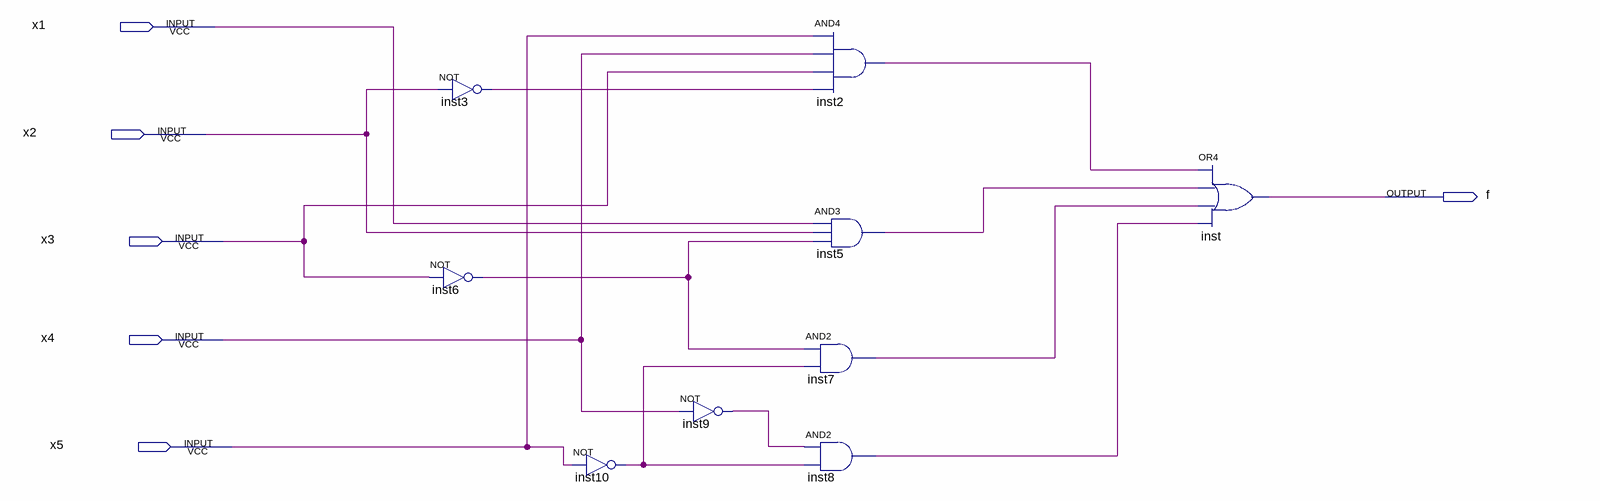
[diagram p0: schematic sheet]
// Quartus schematic Problem1_question3.bdf as structural Verilog: 9 symbols, 6 pins
module Problem1_question3 (
  input  x1,
  input  x2,
  input  x3,
  input  x4,
  input  x5,
  output f
);

  wire inst2_out, inst3_out, inst5_out, inst6_out, inst7_out, inst8_out, inst9_out, inst10_out;

  not inst3 (inst3_out, x2);
  not inst6 (inst6_out, x3);
  not inst10 (inst10_out, x5);
  not inst9 (inst9_out, x4);
  and inst2 (inst2_out, x5, x4, x3, inst3_out);
  and inst5 (inst5_out, x1, x2, inst6_out);
  and inst7 (inst7_out, inst6_out, inst10_out);
  and inst8 (inst8_out, inst9_out, inst10_out);
  or inst (f, inst2_out, inst5_out, inst7_out, inst8_out);
endmodule
